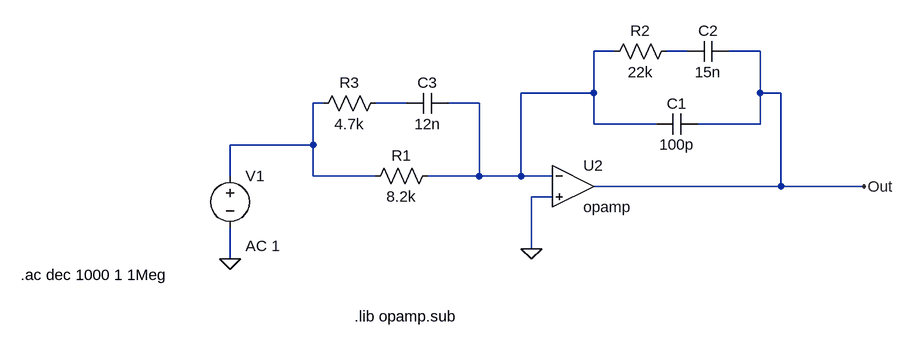
[diagram p0: schematic TypeIII.asc]
TypeIII.asc, the LTspice schematic file:
Version 4
SHEET 1 892 680
WIRE 448 -32 416 -32
WIRE 560 -32 528 -32
WIRE 672 -32 624 -32
WIRE 416 32 416 -32
WIRE 416 32 304 32
WIRE 672 32 672 -32
WIRE 704 32 672 32
WIRE 0 48 -16 48
WIRE 128 48 80 48
WIRE 240 48 192 48
WIRE 416 80 416 32
WIRE 512 80 416 80
WIRE 672 80 672 32
WIRE 672 80 576 80
WIRE -16 112 -16 48
WIRE -16 112 -144 112
WIRE -144 160 -144 112
WIRE -16 160 -16 112
WIRE 80 160 -16 160
WIRE 240 160 240 48
WIRE 240 160 160 160
WIRE 304 160 304 32
WIRE 304 160 240 160
WIRE 352 160 304 160
WIRE 704 176 704 32
WIRE 704 176 416 176
WIRE 832 176 704 176
WIRE 352 192 320 192
WIRE 320 272 320 192
WIRE -144 288 -144 240
FLAG 320 272 0
FLAG -144 288 0
FLAG 832 176 Out
SYMBOL res 64 176 R270
WINDOW 0 32 56 VTop 2
WINDOW 3 0 56 VBottom 2
SYMATTR InstName R1
SYMATTR Value 8.2k
SYMBOL res 432 -16 R270
WINDOW 0 32 56 VTop 2
WINDOW 3 0 56 VBottom 2
SYMATTR InstName R2
SYMATTR Value 22k
SYMBOL cap 576 64 R90
WINDOW 0 0 32 VBottom 2
WINDOW 3 32 32 VTop 2
SYMATTR InstName C1
SYMATTR Value 100p
SYMBOL res -16 64 R270
WINDOW 0 32 56 VTop 2
WINDOW 3 0 56 VBottom 2
SYMATTR InstName R3
SYMATTR Value 4.7k
SYMBOL cap 624 -48 R90
WINDOW 0 0 32 VBottom 2
WINDOW 3 32 32 VTop 2
SYMATTR InstName C2
SYMATTR Value 15n
SYMBOL voltage -144 144 R0
WINDOW 123 24 124 Left 2
WINDOW 39 0 0 Left 0
SYMATTR InstName V1
SYMATTR Value ""
SYMATTR Value2 AC 1
SYMBOL cap 192 32 R90
WINDOW 0 0 32 VBottom 2
WINDOW 3 32 32 VTop 2
SYMATTR InstName C3
SYMATTR Value 12n
SYMBOL opamp 384 112 R0
SYMATTR InstName U2
TEXT -466 312 Left 2 !.ac dec 1000 1 1Meg
TEXT 48 376 Left 2 !.lib opamp.sub

The netlist it stands for:
* TypeIII.asc
R1 N003 N001 8.2k
R2 N001 N002 22k
C1 Out N001 100p
R3 N003 N004 4.7k
C2 Out N002 15n
V1 N003 0 AC 1
C3 N001 N004 12n
XU2 N001 0 Out opamp Aol=100K GBW=10Meg  ; pins invin noninvin out
.ac dec 1000 1 1Meg
.lib opamp.sub
.backanno
.end